# EAGLE design 00A-021 FRDM Protoboard (EAGLE 6.3)

## Sheet 1 of 2
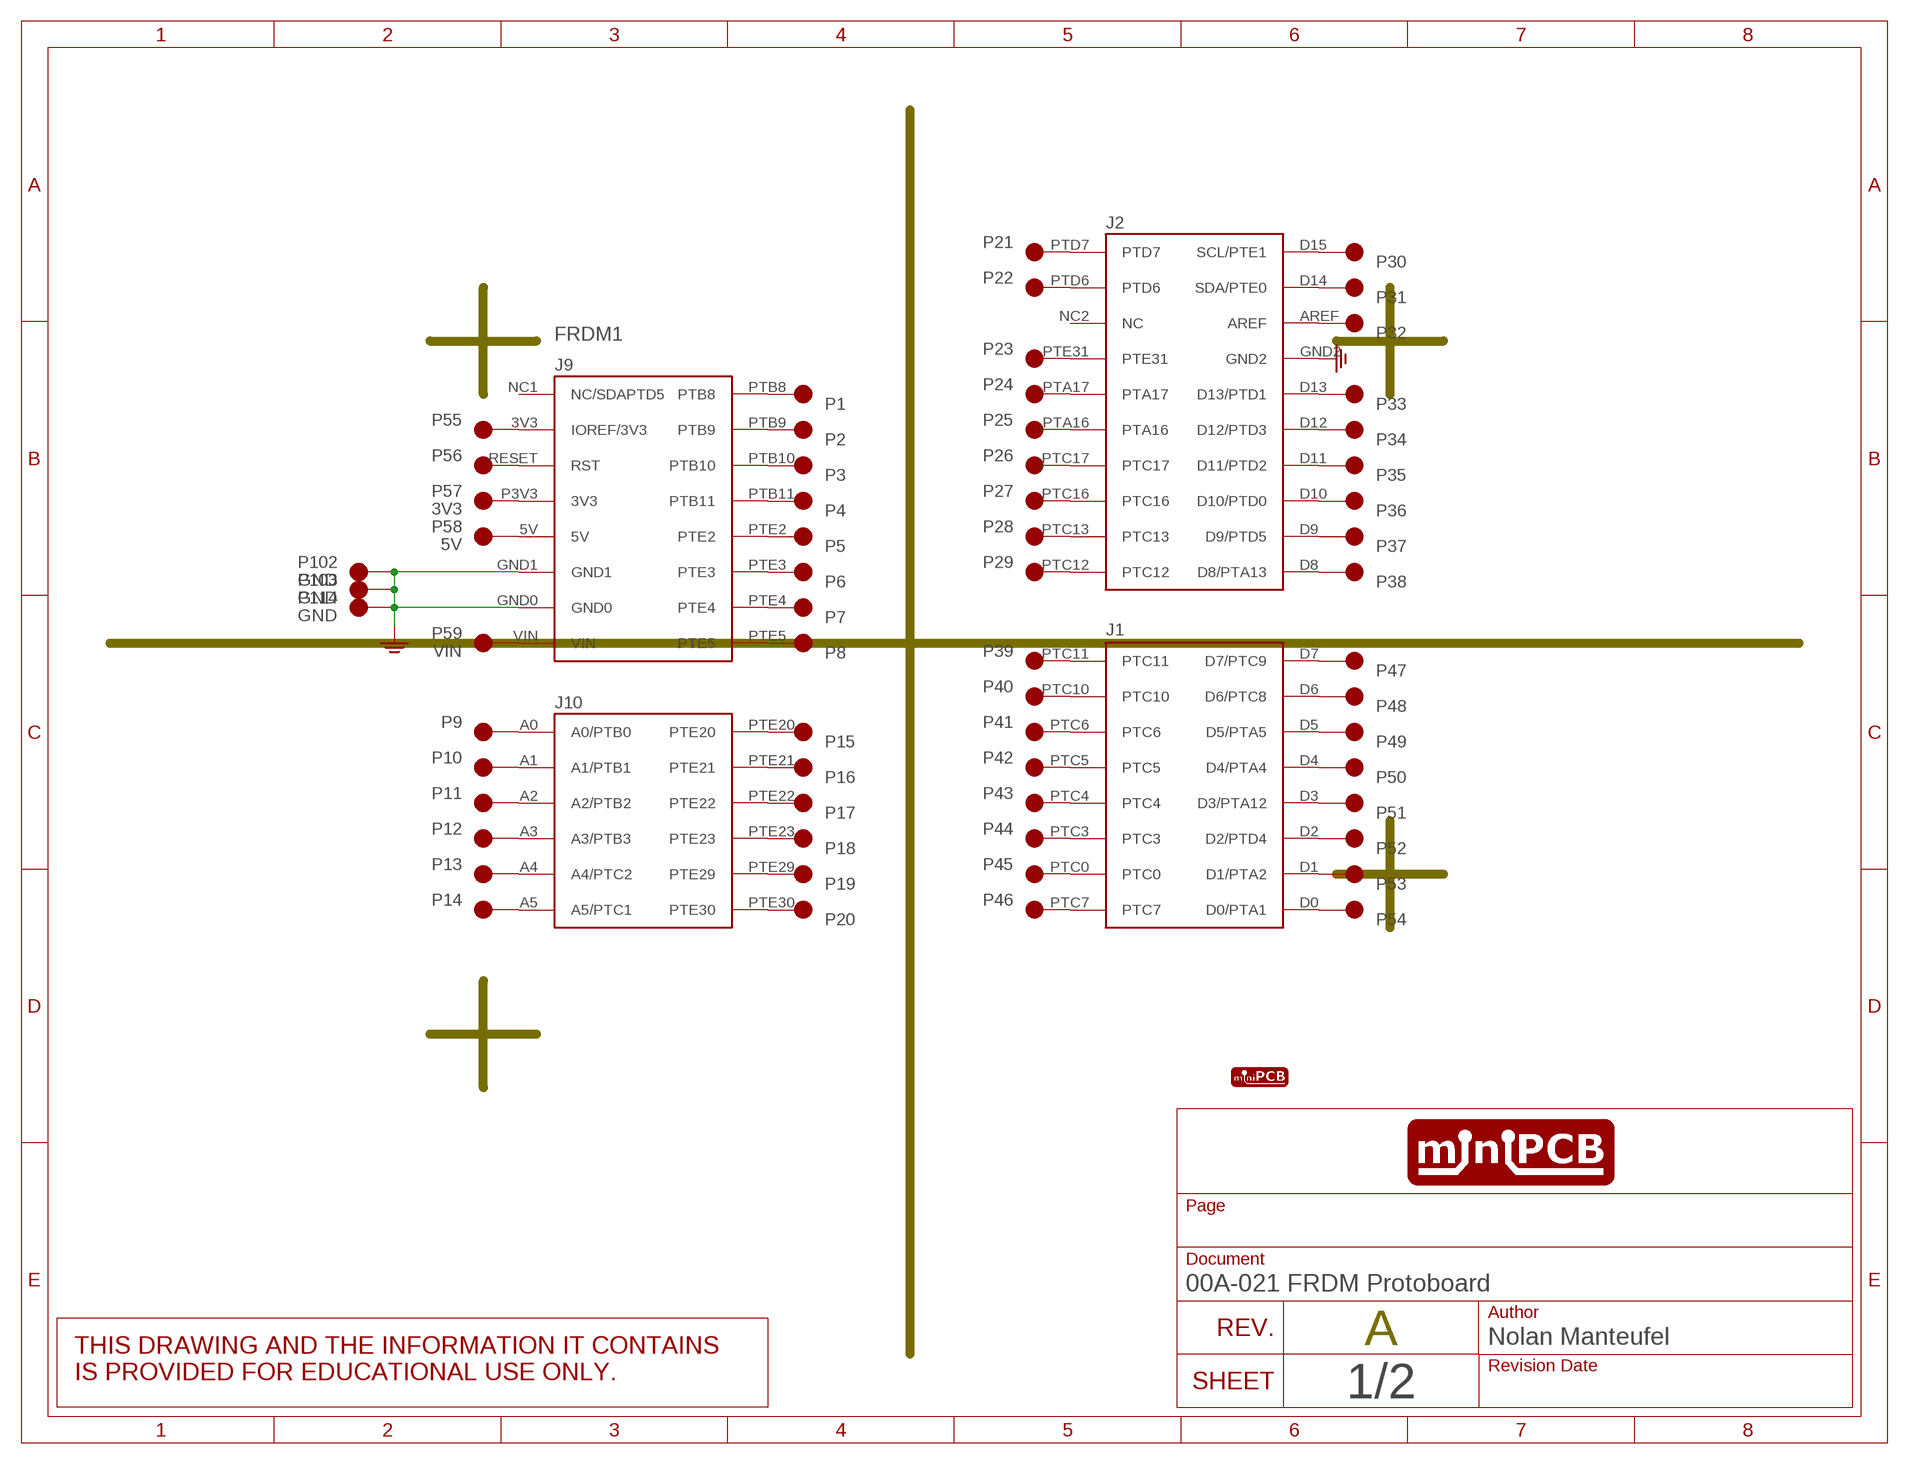
[diagram p0: schematic, sheet 1]

### Parts
FRDM1  FRDM-KL25ZNORMAL  [FRDM_KL25Z_NORMAL]
P1  PINS_11P_VALUE  [PINS_1-1P_VALUE]
P2  PINS_11P_VALUE  [PINS_1-1P_VALUE]
P3  PINS_11P_VALUE  [PINS_1-1P_VALUE]
P4  PINS_11P_VALUE  [PINS_1-1P_VALUE]
P5  PINS_11P_VALUE  [PINS_1-1P_VALUE]
P6  PINS_11P_VALUE  [PINS_1-1P_VALUE]
P7  PINS_11P_VALUE  [PINS_1-1P_VALUE]
P8  PINS_11P_VALUE  [PINS_1-1P_VALUE]
P9  PINS_11P_VALUE  [PINS_1-1P_VALUE]
P10  PINS_11P_VALUE  [PINS_1-1P_VALUE]
P11  PINS_11P_VALUE  [PINS_1-1P_VALUE]
P12  PINS_11P_VALUE  [PINS_1-1P_VALUE]
P13  PINS_11P_VALUE  [PINS_1-1P_VALUE]
P14  PINS_11P_VALUE  [PINS_1-1P_VALUE]
P15  PINS_11P_VALUE  [PINS_1-1P_VALUE]
P16  PINS_11P_VALUE  [PINS_1-1P_VALUE]
P17  PINS_11P_VALUE  [PINS_1-1P_VALUE]
P18  PINS_11P_VALUE  [PINS_1-1P_VALUE]
P19  PINS_11P_VALUE  [PINS_1-1P_VALUE]
P20  PINS_11P_VALUE  [PINS_1-1P_VALUE]
P21  PINS_11P_VALUE  [PINS_1-1P_VALUE]
P22  PINS_11P_VALUE  [PINS_1-1P_VALUE]
P23  PINS_11P_VALUE  [PINS_1-1P_VALUE]
P24  PINS_11P_VALUE  [PINS_1-1P_VALUE]
P25  PINS_11P_VALUE  [PINS_1-1P_VALUE]
P26  PINS_11P_VALUE  [PINS_1-1P_VALUE]
P27  PINS_11P_VALUE  [PINS_1-1P_VALUE]
P28  PINS_11P_VALUE  [PINS_1-1P_VALUE]
P29  PINS_11P_VALUE  [PINS_1-1P_VALUE]
P30  PINS_11P_VALUE  [PINS_1-1P_VALUE]
P31  PINS_11P_VALUE  [PINS_1-1P_VALUE]
P32  PINS_11P_VALUE  [PINS_1-1P_VALUE]
P33  PINS_11P_VALUE  [PINS_1-1P_VALUE]
P34  PINS_11P_VALUE  [PINS_1-1P_VALUE]
P35  PINS_11P_VALUE  [PINS_1-1P_VALUE]
P36  PINS_11P_VALUE  [PINS_1-1P_VALUE]
P37  PINS_11P_VALUE  [PINS_1-1P_VALUE]
P38  PINS_11P_VALUE  [PINS_1-1P_VALUE]
P39  PINS_11P_VALUE  [PINS_1-1P_VALUE]
P40  PINS_11P_VALUE  [PINS_1-1P_VALUE]
P41  PINS_11P_VALUE  [PINS_1-1P_VALUE]
P42  PINS_11P_VALUE  [PINS_1-1P_VALUE]
P43  PINS_11P_VALUE  [PINS_1-1P_VALUE]
P44  PINS_11P_VALUE  [PINS_1-1P_VALUE]
P45  PINS_11P_VALUE  [PINS_1-1P_VALUE]
P46  PINS_11P_VALUE  [PINS_1-1P_VALUE]
P47  PINS_11P_VALUE  [PINS_1-1P_VALUE]
P48  PINS_11P_VALUE  [PINS_1-1P_VALUE]
P49  PINS_11P_VALUE  [PINS_1-1P_VALUE]
P50  PINS_11P_VALUE  [PINS_1-1P_VALUE]
P51  PINS_11P_VALUE  [PINS_1-1P_VALUE]
P52  PINS_11P_VALUE  [PINS_1-1P_VALUE]
P53  PINS_11P_VALUE  [PINS_1-1P_VALUE]
P54  PINS_11P_VALUE  [PINS_1-1P_VALUE]
P55  PINS_11P_VALUE  [PINS_1-1P_VALUE]
P56  PINS_11P_VALUE  [PINS_1-1P_VALUE]
P57  3V3  PINS_13P_VALUE  [PINS_1-3P_VALUE]
P58  5V  PINS_13P_VALUE  [PINS_1-3P_VALUE]
P59  VIN  PINS_13P_VALUE  [PINS_1-3P_VALUE]
P102  GND  PINS_13P_VALUE  [PINS_1-3P_VALUE]
P103  GND  PINS_13P_VALUE  [PINS_1-3P_VALUE]
P114  GND  PINS_13P_VALUE  [PINS_1-3P_VALUE]
U$1  MINIPCB_LOGO  [MINIPCB-LOGO]

### Nets
GND: FRDM1.GND0 FRDM1.GND1 FRDM1.GND2 P102.1 P102.2 P102.3 P103.1 P103.2 P103.3 P114.1 P114.2 P114.3
N$1: FRDM1.PTB8 P1.1
N$2: FRDM1.PTB9 P2.1
N$3: FRDM1.PTB10 P3.1
N$4: FRDM1.PTB11 P4.1
N$5: FRDM1.PTE2 P5.1
N$6: FRDM1.PTE3 P6.1
N$7: FRDM1.PTE4 P7.1
N$8: FRDM1.PTE5 P8.1
N$9: FRDM1.A0(A0/PTB0) P9.1
N$10: FRDM1.A1(A1/PTB1) P10.1
N$11: FRDM1.A2(A2/PTB2) P11.1
N$12: FRDM1.A3(A3/PTB3) P12.1
N$13: FRDM1.A4(A4/PTC2) P13.1
N$14: FRDM1.A5(A5/PTC1) P14.1
N$15: FRDM1.PTE20 P15.1
N$16: FRDM1.PTE21 P16.1
N$17: FRDM1.PTE22 P17.1
N$18: FRDM1.PTE23 P18.1
N$19: FRDM1.PTE29 P19.1
N$20: FRDM1.PTE30 P20.1
N$21: FRDM1.PTD7 P21.1
N$22: FRDM1.PTD6 P22.1
N$23: FRDM1.PTE31 P23.1
N$24: FRDM1.PTA17 P24.1
N$25: FRDM1.PTA16 P25.1
N$26: FRDM1.PTC17 P26.1
N$27: FRDM1.PTC16 P27.1
N$28: FRDM1.PTC13 P28.1
N$29: FRDM1.PTC12 P29.1
N$30: FRDM1.D15(SCL/PTE1) P30.1
N$31: FRDM1.D14(SDA/PTE0) P31.1
N$32: FRDM1.AREF P32.1
N$33: FRDM1.D13(D13/PTD1) P33.1
N$34: FRDM1.D12(D12/PTD3) P34.1
N$35: FRDM1.D11(D11/PTD2) P35.1
N$36: FRDM1.D10(D10/PTD0) P36.1
N$37: FRDM1.D9(D9/PTD5) P37.1
N$38: FRDM1.D8(D8/PTA13) P38.1
N$39: FRDM1.PTC11 P39.1
N$40: FRDM1.PTC10 P40.1
N$41: FRDM1.PTC6 P41.1
N$42: FRDM1.PTC5 P42.1
N$43: FRDM1.PTC4 P43.1
N$44: FRDM1.PTC3 P44.1
N$45: FRDM1.PTC0 P45.1
N$46: FRDM1.PTC7 P46.1
N$47: FRDM1.D7(D7/PTC9) P47.1
N$48: FRDM1.D6(D6/PTC8) P48.1
N$49: FRDM1.D5(D5/PTA5) P49.1
N$50: FRDM1.D4(D4/PTA4) P50.1
N$51: FRDM1.D3(D3/PTA12) P51.1
N$52: FRDM1.D2(D2/PTD4) P52.1
N$53: FRDM1.D1(D1/PTA2) P53.1
N$54: FRDM1.D0(D0/PTA1) P54.1
N$55: FRDM1.3V3(IOREF/3V3) P55.1
N$56: FRDM1.RESET(RST) P56.1
N$57: FRDM1.P3V3(3V3) P57.1 P57.2 P57.3
N$58: FRDM1.5V P58.1 P58.2 P58.3
N$59: FRDM1.VIN P59.1 P59.2 P59.3
Unconnected: FRDM1.NC1(NC/SDAPTD5) FRDM1.NC2(NC)

## Sheet 2 of 2
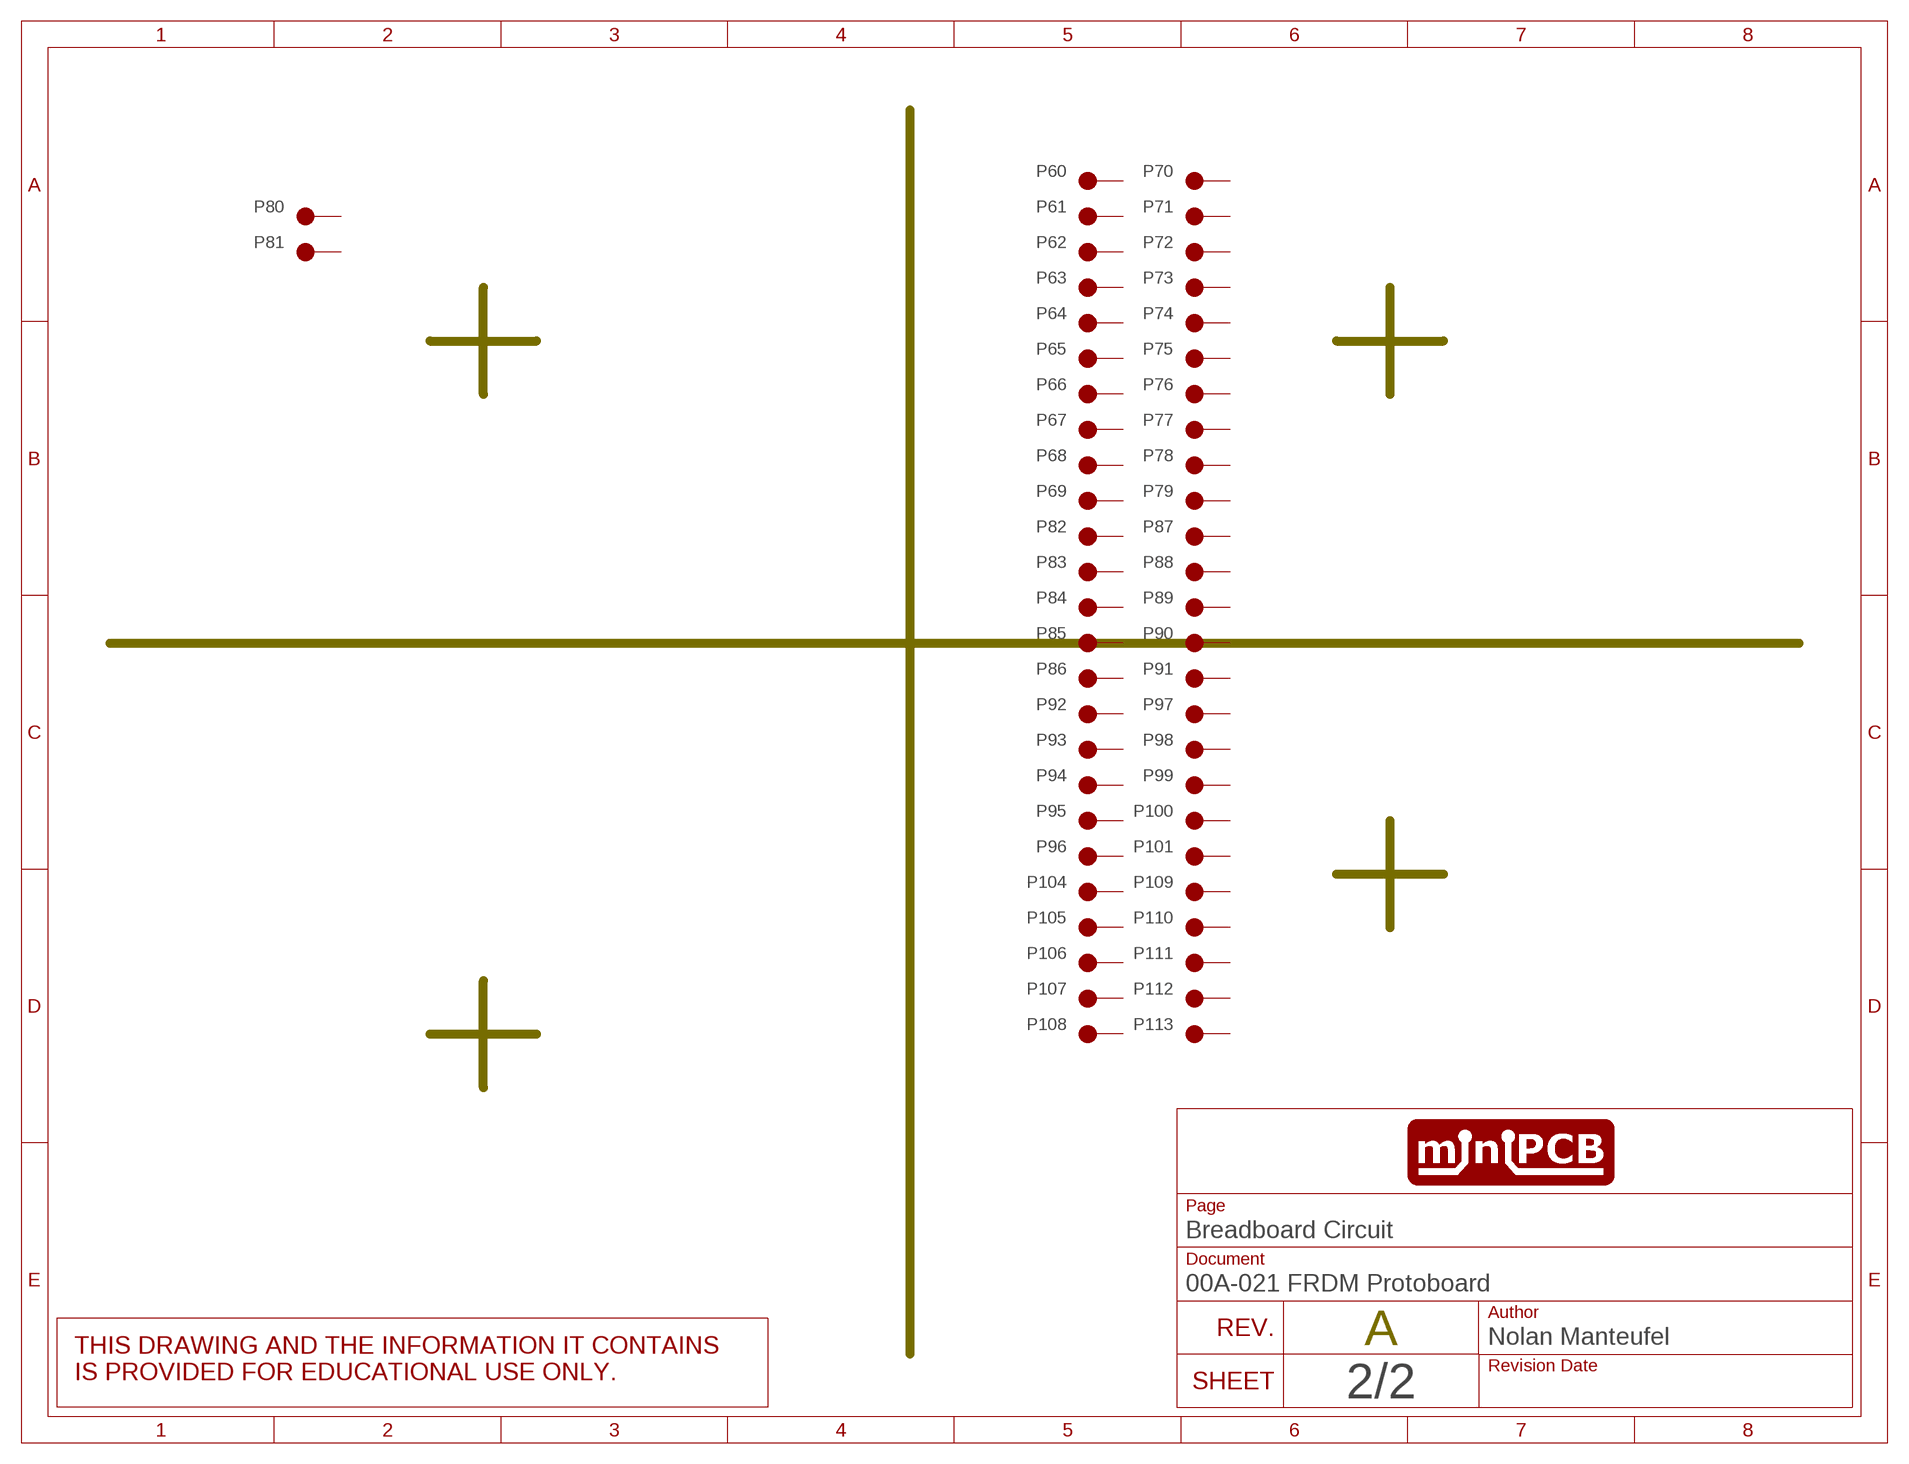
[diagram p1: schematic, sheet 2]

### Parts
P60  PINS_14P_VALUE  [PINS_1_4P_VALUE]
P61  PINS_14P_VALUE  [PINS_1_4P_VALUE]
P62  PINS_14P_VALUE  [PINS_1_4P_VALUE]
P63  PINS_14P_VALUE  [PINS_1_4P_VALUE]
P64  PINS_14P_VALUE  [PINS_1_4P_VALUE]
P65  PINS_14P_VALUE  [PINS_1_4P_VALUE]
P66  PINS_14P_VALUE  [PINS_1_4P_VALUE]
P67  PINS_14P_VALUE  [PINS_1_4P_VALUE]
P68  PINS_14P_VALUE  [PINS_1_4P_VALUE]
P69  PINS_14P_VALUE  [PINS_1_4P_VALUE]
P70  PINS_14P_VALUE  [PINS_1_4P_VALUE]
P71  PINS_14P_VALUE  [PINS_1_4P_VALUE]
P72  PINS_14P_VALUE  [PINS_1_4P_VALUE]
P73  PINS_14P_VALUE  [PINS_1_4P_VALUE]
P74  PINS_14P_VALUE  [PINS_1_4P_VALUE]
P75  PINS_14P_VALUE  [PINS_1_4P_VALUE]
P76  PINS_14P_VALUE  [PINS_1_4P_VALUE]
P77  PINS_14P_VALUE  [PINS_1_4P_VALUE]
P78  PINS_14P_VALUE  [PINS_1_4P_VALUE]
P79  PINS_14P_VALUE  [PINS_1_4P_VALUE]
P80  PINS_1_25P_VALUE  [PINS_1_25P_VALUE]
P81  PINS_1_25P_VALUE  [PINS_1_25P_VALUE]
P82  PINS_14P_VALUE  [PINS_1_4P_VALUE]
P83  PINS_14P_VALUE  [PINS_1_4P_VALUE]
P84  PINS_14P_VALUE  [PINS_1_4P_VALUE]
P85  PINS_14P_VALUE  [PINS_1_4P_VALUE]
P86  PINS_14P_VALUE  [PINS_1_4P_VALUE]
P87  PINS_14P_VALUE  [PINS_1_4P_VALUE]
P88  PINS_14P_VALUE  [PINS_1_4P_VALUE]
P89  PINS_14P_VALUE  [PINS_1_4P_VALUE]
P90  PINS_14P_VALUE  [PINS_1_4P_VALUE]
P91  PINS_14P_VALUE  [PINS_1_4P_VALUE]
P92  PINS_14P_VALUE  [PINS_1_4P_VALUE]
P93  PINS_14P_VALUE  [PINS_1_4P_VALUE]
P94  PINS_14P_VALUE  [PINS_1_4P_VALUE]
P95  PINS_14P_VALUE  [PINS_1_4P_VALUE]
P96  PINS_14P_VALUE  [PINS_1_4P_VALUE]
P97  PINS_14P_VALUE  [PINS_1_4P_VALUE]
P98  PINS_14P_VALUE  [PINS_1_4P_VALUE]
P99  PINS_14P_VALUE  [PINS_1_4P_VALUE]
P100  PINS_14P_VALUE  [PINS_1_4P_VALUE]
P101  PINS_14P_VALUE  [PINS_1_4P_VALUE]
P104  PINS_14P_VALUE  [PINS_1_4P_VALUE]
P105  PINS_14P_VALUE  [PINS_1_4P_VALUE]
P106  PINS_14P_VALUE  [PINS_1_4P_VALUE]
P107  PINS_14P_VALUE  [PINS_1_4P_VALUE]
P108  PINS_14P_VALUE  [PINS_1_4P_VALUE]
P109  PINS_14P_VALUE  [PINS_1_4P_VALUE]
P110  PINS_14P_VALUE  [PINS_1_4P_VALUE]
P111  PINS_14P_VALUE  [PINS_1_4P_VALUE]
P112  PINS_14P_VALUE  [PINS_1_4P_VALUE]
P113  PINS_14P_VALUE  [PINS_1_4P_VALUE]
Unconnected: P60.1 P60.2 P60.3 P60.4 P61.1 P61.2 P61.3 P61.4 P62.1 P62.2 P62.3 P62.4 P63.1 P63.2 P63.3 P63.4 P64.1 P64.2 P64.3 P64.4 P65.1 P65.2 P65.3 P65.4 P66.1 P66.2 P66.3 P66.4 P67.1 P67.2 P67.3 P67.4 P68.1 P68.2 P68.3 P68.4 P69.1 P69.2 P69.3 P69.4 P70.1 P70.2 P70.3 P70.4 P71.1 P71.2 P71.3 P71.4 P72.1 P72.2 P72.3 P72.4 P73.1 P73.2 P73.3 P73.4 P74.1 P74.2 P74.3 P74.4 P75.1 P75.2 P75.3 P75.4 P76.1 P76.2 P76.3 P76.4 P77.1 P77.2 P77.3 P77.4 P78.1 P78.2 P78.3 P78.4 P79.1 P79.2 P79.3 P79.4 P80.1 P80.2 P80.3 P80.4 P80.5 P80.6 P80.7 P80.8 P80.9 P80.10 P80.11 P80.12 P80.13 P80.14 P80.15 P80.16 P80.17 P80.18 P80.19 P80.20 P80.21 P80.22 P80.23 P80.24 P80.25 P81.1 P81.2 P81.3 P81.4 P81.5 P81.6 P81.7 P81.8 P81.9 P81.10 P81.11 P81.12 P81.13 P81.14 P81.15 P81.16 P81.17 P81.18 P81.19 P81.20 P81.21 P81.22 P81.23 P81.24 P81.25 P82.1 P82.2 P82.3 P82.4 P83.1 P83.2 P83.3 P83.4 P84.1 P84.2 P84.3 P84.4 P85.1 P85.2 P85.3 P85.4 P86.1 P86.2 P86.3 P86.4 P87.1 P87.2 P87.3 P87.4 P88.1 P88.2 P88.3 P88.4 P89.1 P89.2 P89.3 P89.4 P90.1 P90.2 P90.3 P90.4 P91.1 P91.2 P91.3 P91.4 P92.1 P92.2 P92.3 P92.4 P93.1 P93.2 P93.3 P93.4 P94.1 P94.2 P94.3 P94.4 P95.1 P95.2 P95.3 P95.4 P96.1 P96.2 P96.3 P96.4 P97.1 P97.2 P97.3 P97.4 P98.1 P98.2 P98.3 P98.4 P99.1 P99.2 P99.3 P99.4 P100.1 P100.2 P100.3 P100.4 P101.1 P101.2 P101.3 P101.4 P104.1 P104.2 P104.3 P104.4 P105.1 P105.2 P105.3 P105.4 P106.1 P106.2 P106.3 P106.4 P107.1 P107.2 P107.3 P107.4 P108.1 P108.2 P108.3 P108.4 P109.1 P109.2 P109.3 P109.4 P110.1 P110.2 P110.3 P110.4 P111.1 P111.2 P111.3 P111.4 P112.1 P112.2 P112.3 P112.4 P113.1 P113.2 P113.3 P113.4

## Library data of the parts
FRDM1 = nolan:FRDM-KL25Z: For creating FRDM-KL25Z shields Check prices <https://pricing.snapeda.com/parts/FRDM-KL25Z/NXP%20USA/view-part?ref=eda>; AVAILABILITY: In Stock; DESCRIPTION: KL1x, KL2x, mbed-Enabled Development Freedom Kinetis ARM® Cortex®-M0+ MCU 32-Bit Embedded Evaluation Board; MF: NXP USA; MP: FRDM-KL25Z; PACKAGE: 0805 Freescale Semiconductor; PRICE: None; PURCHASE-URL: https://pricing.snapeda.com/search/part/FRDM-KL25Z/?ref=eda
P1-P114 = nolan:PINS_1
U$1 = nolan:MINIPCB_LOGO

## Board
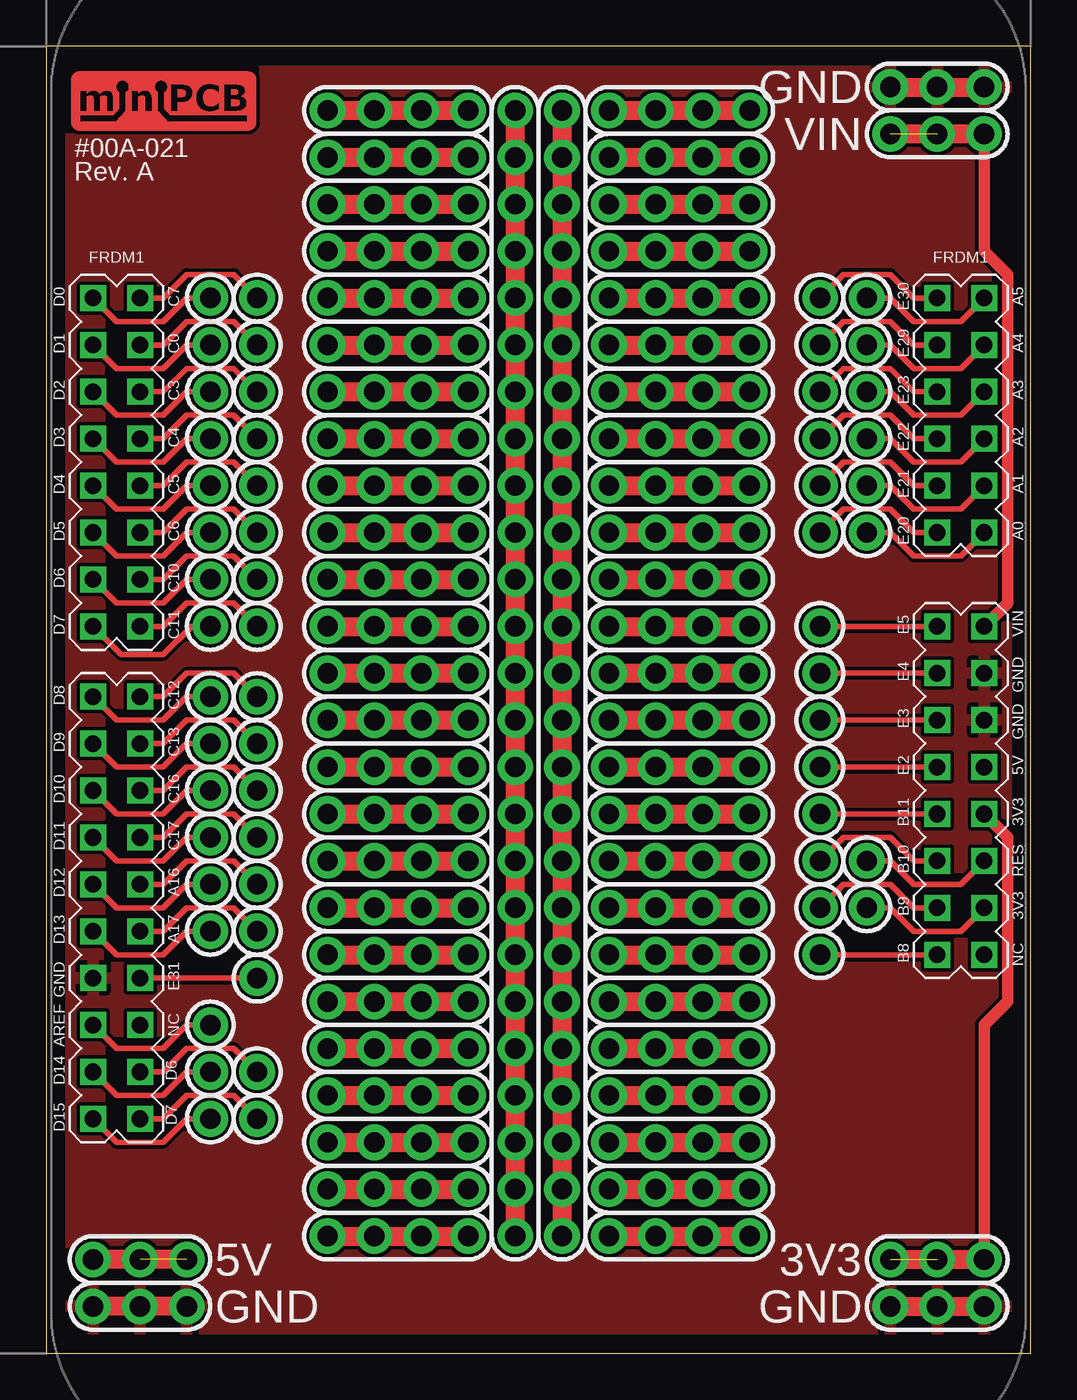
[diagram p2: board, top side]
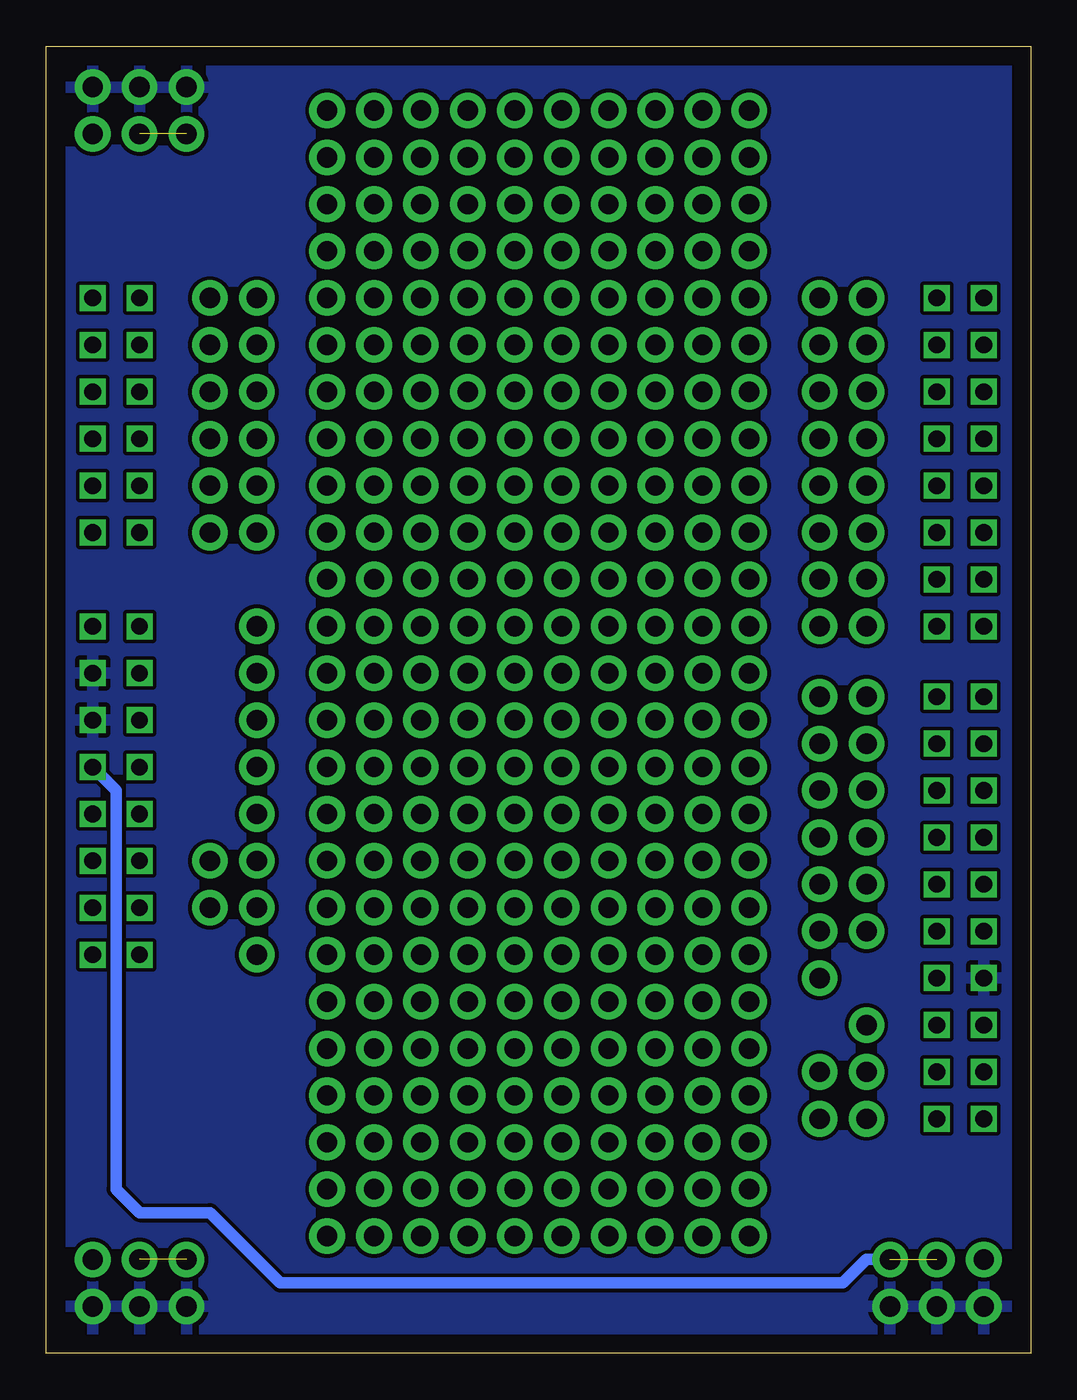
[diagram p3: board, bottom side, seen from below]

Size 53.32 x 70.79 mm. Coordinates in mm from the lower left corner, seen from the top.
Outline: 0,0 53.32,0 53.32,70.79 0,70.79 0,0
Copper layers (1*16): Top 0.035mm / dielectric 1.5mm / Bottom 0.035mm
Design rules "default": minimum track width 10mil, minimum drill 24mil, track to track 8mil, track to pad 8mil, pad to pad 8mil, via to via 8mil, smd to smd 8mil, copper to edge 40mil, drill to drill 8mil, minimum pad ring 10mil, minimum via ring 8mil, stop-mask expansion 4mil, vias tented up to drill 0mil, thermal gap 10mil

### Footprints (pad centres in the part's own frame; a part is rotated, then mirrored left to right if it is on the bottom)
FRDM_KL25Z_NORMAL = drill 0.9 square: 3V3 24.13,-15.24; 5V 24.13,-7.62; A0 24.13,5.08; A1 24.13,7.62; A2 24.13,10.16; A3 24.13,12.7; A4 24.13,15.24; A5 24.13,17.78; AREF -24.13,-21.59; D0 -24.13,17.78; D1 -24.13,15.24; D2 -24.13,12.7; D3 -24.13,10.16; D4 -24.13,7.62; D5 -24.13,5.08; D6 -24.13,2.54; D7 -24.13,0; D8 -24.13,-3.81; D9 -24.13,-6.35; D10 -24.13,-8.89; D11 -24.13,-11.43; D12 -24.13,-13.97; D13 -24.13,-16.51; D14 -24.13,-24.13; D15 -24.13,-26.67; GND0 24.13,-2.54; GND1 24.13,-5.08; GND2 -24.13,-19.05; NC1 24.13,-17.78; NC2 -21.59,-21.59; P3V3 24.13,-10.16; PTA16 -21.59,-13.97; PTA17 -21.59,-16.51; PTB8 21.59,-17.78; PTB9 21.59,-15.24; PTB10 21.59,-12.7; PTB11 21.59,-10.16; PTC0 -21.59,15.24; PTC3 -21.59,12.7; PTC4 -21.59,10.16; PTC5 -21.59,7.62; PTC6 -21.59,5.08; PTC7 -21.59,17.78; PTC10 -21.59,2.54; PTC11 -21.59,0; PTC12 -21.59,-3.81; PTC13 -21.59,-6.35; PTC16 -21.59,-8.89; PTC17 -21.59,-11.43; PTD6 -21.59,-24.13; PTD7 -21.59,-26.67; PTE2 21.59,-7.62; PTE3 21.59,-5.08; PTE4 21.59,-2.54; PTE5 21.59,0; PTE20 21.59,5.08; PTE21 21.59,7.62; PTE22 21.59,10.16; PTE23 21.59,12.7; PTE29 21.59,15.24; PTE30 21.59,17.78; PTE31 -21.59,-19.05; RESET 24.13,-12.7; VIN 24.13,0
PINS_1-1P_VALUE = drill 1.1 pad 1.93: 1 0,0
PINS_1-3P_VALUE = drill 1.1 pad 1.93: 1 0,0; 2 2.54,0; 3 5.08,0
PINS_1_4P_VALUE = drill 1.1 pad 1.93: 1 0,0; 2 2.54,0; 3 5.08,0; 4 7.62,0
PINS_1_25P_VALUE = drill 1.1 pad 1.93: 1 0,0; 2 2.54,0; 3 5.08,0; 4 7.62,0; 5 10.16,0; 6 12.7,0; 7 15.24,0; 8 17.78,0; 9 20.32,0; 10 22.86,0; 11 25.4,0; 12 27.94,0; 13 30.48,0; 14 33.02,0; 15 35.56,0; 16 38.1,0; 17 40.64,0; 18 43.18,0; 19 45.72,0; 20 48.26,0; 21 50.8,0; 22 53.34,0; 23 55.88,0; 24 58.42,0; 25 60.96,0

### Placement (x,y rotation side)
FRDM1  26.67,39.37 0 top
P1  41.91,21.59 0 top
P2  41.91,24.13 270 top
P3  41.91,26.67 270 top
P4  41.91,29.21 270 top
P5  41.91,31.75 270 top
P6  41.91,34.29 270 top
P7  41.91,36.83 270 top
P8  41.91,39.37 270 top
P9  44.45,44.45 270 top
P10  44.45,46.99 270 top
P11  44.45,49.53 270 top
P12  44.45,52.07 270 top
P13  44.45,54.61 270 top
P14  44.45,57.15 0 top
P15  41.91,44.45 0 top
P16  41.91,46.99 270 top
P17  41.91,49.53 270 top
P18  41.91,52.07 0 top
P19  41.91,54.61 0 top
P20  41.91,57.15 0 top
P21  11.43,12.7 270 top
P22  11.43,15.24 270 top
P23  11.43,20.32 270 top
P24  11.43,22.86 270 top
P25  11.43,25.4 270 top
P26  11.43,27.94 270 top
P27  11.43,30.48 270 top
P28  11.43,33.02 270 top
P29  11.43,35.56 270 top
P30  8.89,12.7 270 top
P31  8.89,15.24 270 top
P32  8.89,17.78 270 top
P33  8.89,22.86 270 top
P34  8.89,25.4 270 top
P35  8.89,27.94 270 top
P36  8.89,30.48 270 top
P37  8.89,33.02 270 top
P38  8.89,35.56 270 top
P39  11.43,39.37 270 top
P40  11.43,41.91 270 top
P41  11.43,44.45 270 top
P42  11.43,46.99 270 top
P43  11.43,49.53 270 top
P44  11.43,52.07 270 top
P45  11.43,54.61 270 top
P46  11.43,57.15 270 top
P47  8.89,39.37 270 top
P48  8.89,41.91 270 top
P49  8.89,44.45 270 top
P50  8.89,46.99 270 top
P51  8.89,49.53 270 top
P52  8.89,52.07 270 top
P53  8.89,54.61 270 top
P54  8.89,57.15 270 top
P55  44.45,24.13 0 top
P56  44.45,26.67 90 top
P57  45.72,5.08 0 top
P58  7.62,5.08 180 top
P59  45.72,66.04 0 top
P60  30.48,67.31 0 top
P61  30.48,64.77 0 top
P62  30.48,62.23 0 top
P63  30.48,59.69 0 top
P64  30.48,57.15 0 top
P65  30.48,54.61 0 top
P66  30.48,52.07 0 top
P67  30.48,49.53 0 top
P68  30.48,46.99 0 top
P69  30.48,44.45 0 top
P70  15.24,67.31 0 top
P71  15.24,54.61 0 top
P72  15.24,64.77 0 top
P73  15.24,52.07 0 top
P74  15.24,62.23 0 top
P75  15.24,49.53 0 top
P76  15.24,59.69 0 top
P77  15.24,46.99 0 top
P78  15.24,57.15 0 top
P79  15.24,44.45 0 top
P80  27.94,67.31 270 top
P81  25.4,67.31 270 top
P82  15.24,41.91 0 top
P83  15.24,39.37 0 top
P84  15.24,36.83 0 top
P85  15.24,34.29 0 top
P86  15.24,31.75 0 top
P87  30.48,41.91 0 top
P88  30.48,39.37 0 top
P89  30.48,36.83 0 top
P90  30.48,34.29 0 top
P91  30.48,31.75 0 top
P92  15.24,29.21 0 top
P93  15.24,26.67 0 top
P94  15.24,24.13 0 top
P95  15.24,21.59 0 top
P96  15.24,19.05 0 top
P97  30.48,29.21 0 top
P98  30.48,26.67 0 top
P99  30.48,24.13 0 top
P100  30.48,21.59 0 top
P101  30.48,19.05 0 top
P102  45.72,2.54 0 top
P103  7.62,2.54 180 top
P104  15.24,16.51 0 top
P105  15.24,13.97 0 top
P106  15.24,11.43 0 top
P107  15.24,8.89 0 top
P108  15.24,6.35 0 top
P109  30.48,16.51 0 top
P110  30.48,13.97 0 top
P111  30.48,11.43 0 top
P112  30.48,8.89 0 top
P113  30.48,6.35 0 top
P114  45.72,68.58 0 top
U$1  6.35,67.82 0 top

### Tracks (layer width: path | path; a pad name or v marks a point on that pad's centre or on a via)
GND
  pour Top: 1.27,1.27 52.07,1.27 52.07,69.85 1.27,69.85
  pour Bottom: 1.27,1.27 52.07,1.27 52.07,69.85 1.27,69.85
N$1
  Top 0.305: P1.1 FRDM1.PTB8
N$2
  Top 0.305: FRDM1.PTB9 46.99,24.13 45.72,25.4 43.18,25.4 P2.1
N$3
  Top 0.305: FRDM1.PTB10 46.99,26.67 45.72,27.94 43.18,27.94 P3.1
N$4
  Top 0.305: P4.1 FRDM1.PTB11
N$5
  Top 0.305: P5.1 FRDM1.PTE2
N$6
  Top 0.305: P6.1 FRDM1.PTE3
N$7
  Top 0.305: P7.1 FRDM1.PTE4
N$8
  Top 0.305: P8.1 FRDM1.PTE5
N$9
  Top 0.305: FRDM1.A0 49.53,43.18 46.99,43.18 45.72,44.45 P9.1
N$10
  Top 0.305: FRDM1.A1 49.53,45.72 46.99,45.72 45.72,46.99 P10.1
N$11
  Top 0.305: FRDM1.A2 49.53,48.26 46.99,48.26 45.72,49.53 P11.1
N$12
  Top 0.305: FRDM1.A3 49.53,50.8 46.99,50.8 45.72,52.07 P12.1
N$13
  Top 0.305: FRDM1.A4 49.53,53.34 46.99,53.34 45.72,54.61 P13.1
N$14
  Top 0.305: FRDM1.A5 49.53,55.88 46.99,55.88 45.72,57.15 P14.1
N$15
  Top 0.305: FRDM1.PTE20 46.99,44.45 45.72,45.72 43.18,45.72 P15.1
N$16
  Top 0.305: FRDM1.PTE21 46.99,46.99 45.72,48.26 43.18,48.26 P16.1
N$17
  Top 0.305: FRDM1.PTE22 46.99,49.53 45.72,50.8 43.18,50.8 P17.1
N$18
  Top 0.305: FRDM1.PTE23 46.99,52.07 45.72,53.34 43.18,53.34 P18.1
N$19
  Top 0.305: FRDM1.PTE29 46.99,54.61 45.72,55.88 43.18,55.88 P19.1
N$20
  Top 0.305: FRDM1.PTE30 46.99,57.15 45.72,58.42 43.18,58.42 P20.1
N$21
  Top 0.305: FRDM1.PTD7 6.35,12.7 7.62,13.97 10.16,13.97 P21.1
N$22
  Top 0.305: FRDM1.PTD6 6.35,15.24 7.62,16.51 10.16,16.51 P22.1
N$23
  Top 0.305: FRDM1.PTE31 P23.1
N$24
  Top 0.305: FRDM1.PTA17 6.35,22.86 7.62,24.13 10.16,24.13 P24.1
N$25
  Top 0.305: FRDM1.PTA16 6.35,25.4 7.62,26.67 10.16,26.67 P25.1
N$26
  Top 0.305: FRDM1.PTC17 6.35,27.94 7.62,29.21 10.16,29.21 P26.1
N$27
  Top 0.305: FRDM1.PTC16 6.35,30.48 7.62,31.75 10.16,31.75 P27.1
N$28
  Top 0.305: FRDM1.PTC13 6.35,33.02 7.62,34.29 10.16,34.29 P28.1
N$29
  Top 0.305: FRDM1.PTC12 6.35,35.56 7.62,36.83 10.16,36.83 P29.1
N$30
  Top 0.305: FRDM1.D15 3.81,11.43 6.35,11.43 7.62,12.7 P30.1
N$31
  Top 0.305: FRDM1.D14 3.81,13.97 6.35,13.97 7.62,15.24 P31.1
N$32
  Top 0.305: FRDM1.AREF 3.81,16.51 6.35,16.51 7.62,17.78 P32.1
N$33
  Top 0.305: FRDM1.D13 3.81,21.59 6.35,21.59 7.62,22.86 P33.1
N$34
  Top 0.305: FRDM1.D12 3.81,24.13 6.35,24.13 7.62,25.4 P34.1
N$35
  Top 0.305: FRDM1.D11 3.81,26.67 6.35,26.67 7.62,27.94 P35.1
N$36
  Top 0.305: FRDM1.D10 3.81,29.21 6.35,29.21 7.62,30.48 P36.1
N$37
  Top 0.305: FRDM1.D9 3.81,31.75 6.35,31.75 7.62,33.02 P37.1
N$38
  Top 0.305: FRDM1.D8 3.81,34.29 6.35,34.29 7.62,35.56 P38.1
N$39
  Top 0.305: FRDM1.PTC11 6.35,39.37 7.62,40.64 10.16,40.64 P39.1
N$40
  Top 0.305: FRDM1.PTC10 6.35,41.91 7.62,43.18 10.16,43.18 P40.1
N$41
  Top 0.305: FRDM1.PTC6 6.35,44.45 7.62,45.72 10.16,45.72 P41.1
N$42
  Top 0.305: FRDM1.PTC5 6.35,46.99 7.62,48.26 10.16,48.26 P42.1
N$43
  Top 0.305: FRDM1.PTC4 6.35,49.53 7.62,50.8 10.16,50.8 P43.1
N$44
  Top 0.305: FRDM1.PTC3 6.35,52.07 7.62,53.34 10.16,53.34 P44.1
N$45
  Top 0.305: FRDM1.PTC0 6.35,54.61 7.62,55.88 10.16,55.88 P45.1
N$46
  Top 0.305: FRDM1.PTC7 6.35,57.15 7.62,58.42 10.16,58.42 P46.1
N$47
  Top 0.305: FRDM1.D7 4.06,37.85 6.35,37.85 7.87,39.37 P47.1
N$48
  Top 0.305: FRDM1.D6 3.81,40.64 6.35,40.64 7.62,41.91 P48.1
N$49
  Top 0.305: FRDM1.D5 3.81,43.18 6.35,43.18 7.62,44.45 P49.1
N$50
  Top 0.305: FRDM1.D4 3.81,45.72 6.35,45.72 7.62,46.99 P50.1
N$51
  Top 0.305: FRDM1.D3 3.81,48.26 6.35,48.26 7.62,49.53 P51.1
N$52
  Top 0.305: FRDM1.D2 3.81,50.8 6.35,50.8 7.62,52.07 P52.1
N$53
  Top 0.305: FRDM1.D1 3.81,53.34 6.35,53.34 7.62,54.61 P53.1
N$54
  Top 0.305: FRDM1.D0 3.81,55.88 6.35,55.88 7.62,57.15 P54.1
N$55
  Top 0.305: FRDM1.3V3 49.53,22.86 46.99,22.86 45.72,24.13 P55.1
N$56
  Top 0.305: FRDM1.RESET 49.53,25.4 46.99,25.4 45.72,26.67 P56.1
N$57  (1 unrouted)
  Top 0.61: FRDM1.P3V3 52.07,27.94 52.07,19.05 50.8,17.78 P57.3
N$58  (1 unrouted)
  Bottom 0.61: FRDM1.5V 49.53,30.48 49.53,8.89 48.26,7.62 44.45,7.62 40.64,3.81 10.16,3.81 8.89,5.08 P58.1
N$59  (1 unrouted)
  Top 0.61: FRDM1.VIN 52.07,40.64 52.07,58.42 50.8,59.69 P59.3

### Text on the board
tPlace: #00A-021 | Rev. A